# Altium project MQP_PCB.PrjPcb (part 1 of 2)
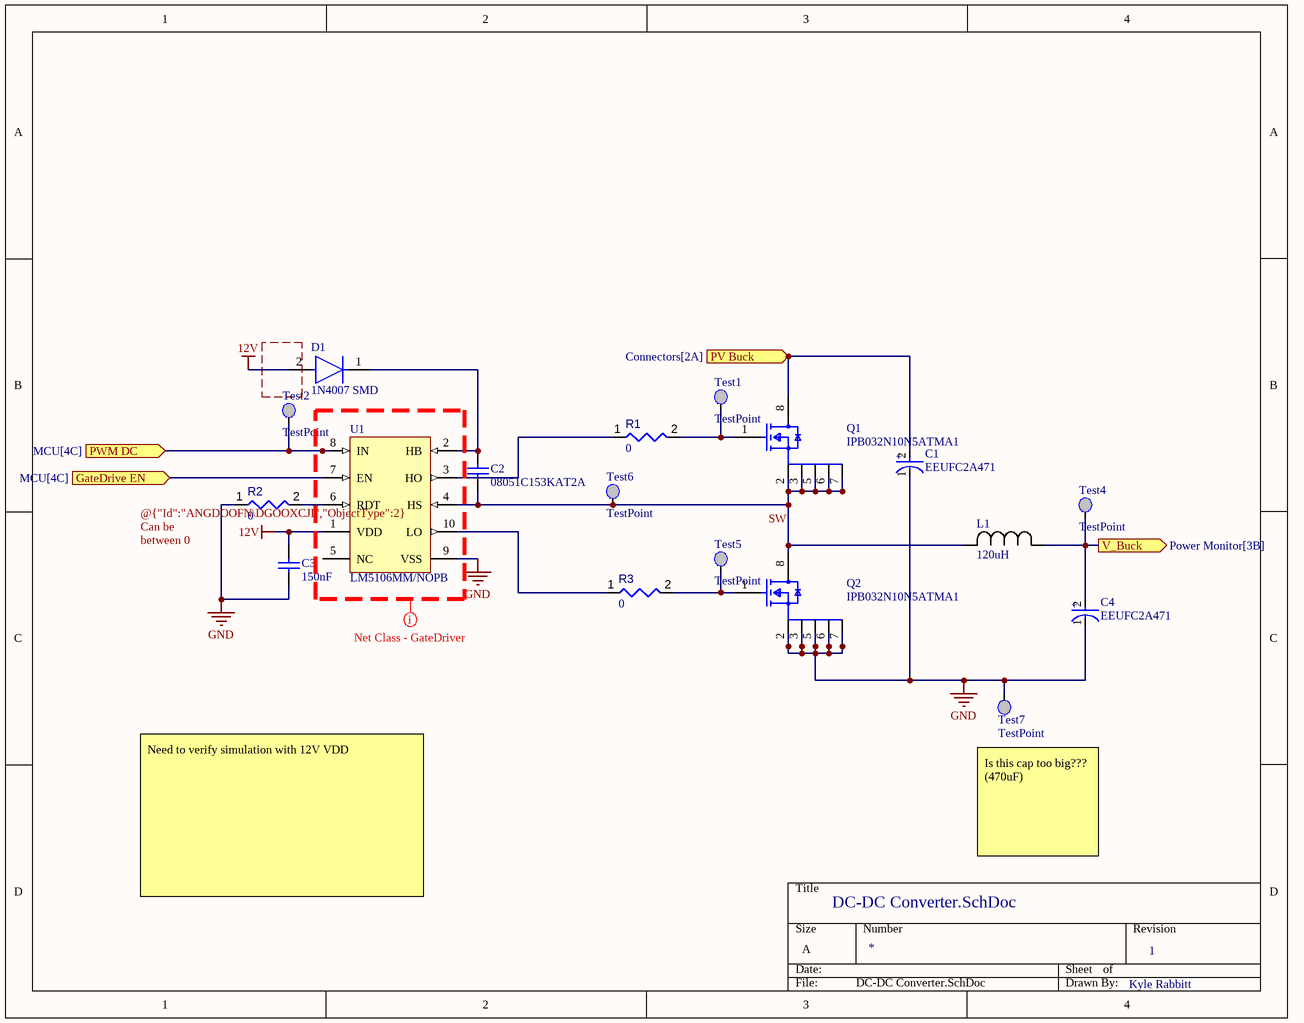
[diagram p0: DC-DC Converter.SchDoc]
Author: Kyle Rabbitt; Revision: 1
7 sheets, 188 parts. Net scope: flat (ports and power ports of the same name join across sheets).
Board files: 630-DC2044B_REV01_DESIGN_LAYOUT.PcbDoc, PCB_Main.PcbDoc
Sheets:
  DC-DC Converter.SchDoc
  MCU.SchDoc
  Sensors.SchDoc
  Voltage Regulator.SchDoc
  Power Monitor.SchDoc
  Connectors.SchDoc
  FCC Footprint Charge Controller.SchDoc

## Sheet DC-DC Converter.SchDoc
size A; SheetNumber: 1; SheetTotal: 7

### Parts
C1  EEUFC2A471  [FP-RAD-TH-D_16_0_5-L_40_2-MFG]
C2  08051C153KAT2A  [CAPC2013X94X50NL20T25]
C3  150nF  [CAPC2013X140X50LL20T25]
C4  EEUFC2A471  [FP-RAD-TH-D_16_0_5-L_40_2-MFG]
D1  1N4007 SMD  [FP-1N4007_SMD-IPC_C]
L1  120uH  [IND_2300HT-V_56_42]
Q1  IPB032N10N5ATMA1  [FP-PG-TO263-7-MFG]
Q2  IPB032N10N5ATMA1  [FP-PG-TO263-7-MFG]
R1  value 0  [RESC0603(1608)_L]  (hidden comment: 0R3J)
R2  value 0  [RESC0603(1608)_L]  (hidden comment: 0R3J)
R3  value 0  [RESC0603(1608)_L]  (hidden comment: 0R3J)
Test1  TestPoint  [Test_IN]  (no BOM)
Test2  TestPoint  [Test_IN]  (no BOM)
Test4  TestPoint  [Test_IN]  (no BOM)
Test5  TestPoint  [Test_IN]  (no BOM)
Test6  TestPoint  [Test_IN]  (no BOM)
Test7  TestPoint  [Test_IN]  (no BOM)
U1  LM5106MM/NOPB  [DGS0010A_N]

### Ports
GateDrive EN (in, see MCU[4C]), PV Buck (in, see Connectors[2A]), PWM DC (in, see MCU[4C]), V_Buck (out, see Power Monitor[3B])

### Nets
12V: C3.2 D1.2(A) U1.1(VDD)
GND: C1.1(C) C3.1 C4.1(C) Q2.2(SOURCE) Q2.3(SOURCE) Q2.5(SOURCE) Q2.6(SOURCE) Q2.7(SOURCE) R2.1 Test7.IN U1.9(VSS)
SW: C2.1 L1.2 Q1.2(SOURCE) Q1.3(SOURCE) Q1.5(SOURCE) Q1.6(SOURCE) Q1.7(SOURCE) Q2.8(DRAIN) Test6.IN U1.4(HS)
NetC1_2: C1.2(A) Q1.8(DRAIN) ; port PV Buck
NetC2_2: C2.2 D1.1(C) U1.2(HB)
NetC4_2: C4.2(A) L1.1 Test4.IN ; port V_Buck
NetQ1_1: Q1.1(GATE) R1.2 Test1.IN
NetQ2_1: Q2.1(GATE) R3.2 Test5.IN
NetR1_1: R1.1 U1.3(HO)
NetR2_2: R2.2 U1.6(RDT)
NetR3_1: R3.1 U1.10(LO)
NetTest2_IN: Test2.IN U1.8(IN) ; port PWM DC
NetU1_7: U1.7(EN) ; port GateDrive EN

Not connected (* = marked no-connect by the designer): U1 5(NC)

### Layout directives
net class GateDriver: (no net found under the mark)

### Notes on the sheet
- (near R2) @{"Id":"ANGDOOFN\DGOOXCJI","ObjectType":2} Can be between 0 and 150k
- Need to verify simulation with 12V VDD
- (near Test7) Is this cap too big???
  (470uF)
- (in symbol CMP-05427-000270-1) +

### Library data of the parts
C1 C4 = CMP-05427-000270-1: Aluminum Electrolytic Capacitors (Radial Lead Type) AEC-Q200 Qualified 470uF ±20% 100V; Ripple Current: 1.92A; Impedance: 47mR; Polarity: Polar; Dielectric Material: Aluminium; Lead Diameter: 0.8mm; Life (Hours): 5000Hour; Leakage Current: 3uA; Radiation Hardening: No; REACH SVHC: No SVHC; Height: 40mm; Ratings: AEC-Q200; Max Operating Temperature: 105°C; RoHS Compliant: Yes; Construction: RADIAL; Lead Pitch: 7.5mm; Contact Plating: Tin; Voltage: 100V; Length: 40mm; Packaging: Bulk; Diameter: 16mm; Height - Seated (Max): 1.575inch; Voltage Rating (DC): 100V; Voltage Rating: 100V; ESR (Equivalent Series Resistance): 47mR; Case/Package: Radial; Lead Free: Lead Free; Tolerance: 20%; Series: FC; Capacitance: 470uF; Package Quantity: 100; Mount: Through Hole; Min Operating Temperature: -55°C; Termination: Radial
C2 = CMP-2007-04180-1: 15nF / 0.01uF; Manufacturer: AVX Interconnect / Elco; Part Number: 08051C153KAT2A
C3 = CMP-1036-04480-3: 08053C154KAT2A; Manufacturer: AVX Interconnect / Elco; Part Number: 08053C154KAT2A
D1 = CMP-12389-000001-1: Rectifier, 1Kv, 1A, Do-214Ac Rohs Compliant: Yes
L1 = 2300HT-121-V-RC: 120uH / 2300HT-121-V-RC; Mfr_Name: Bourns Electronics
Q1 Q2 = CMP-32901-001276-1: MOSFET N-CH 100V 166A TO263-7; Input Capacitance: 6.97nF; Max Power Dissipation: 187W; Rds On Max: 3.2mR; Min Operating Temperature: -55°C; Mount: Surface Mount; RoHS Compliant: Yes; Continuous Drain Current (ID): 166A; Packaging: Tape and Reel; Case/Package: TO-263-7; Halogen Free: Halogen Free; Max Dual Supply Voltage: 100V; Lead Free: Contains Lead; Drain to Source Voltage (Vdss): 100V; Max Operating Temperature: 175°C; Series: OptiMOS™
R1-R3 = CMP-009-00063-2: Jumper 0603 (1608 Metric); Case/Package: 0603; Mounting Technology: SMT; Pins: 2
U1 = CMP-0063-01354-3: 100V Half-Bridge Gate Driver with Programmable Dead-Time, 10-pin MSOP, Pb-Free; Manufacturer: Texas Instruments; PackageTopMarking: ZXTT*5106; PowerWise: N; CompType: MiscPower; PinCount: 10; Code_JEDEC: MO-187-BA; PackageReference: DGS0010A; PackageDescription: Mini-SO, Molded, .118 x .118 x .034in Body, 10 Lead, .0197in Pitch; ComponentLink1URL: http://www.ti.com/general/docs/lit/getliterature.tsp?genericPartNumber=LM5106&fileType=pdf; ComponentLink1Description: Datasheet URL; RoHS: Y

## Sheet MCU.SchDoc
size A; SheetNumber: 2; SheetTotal: 7
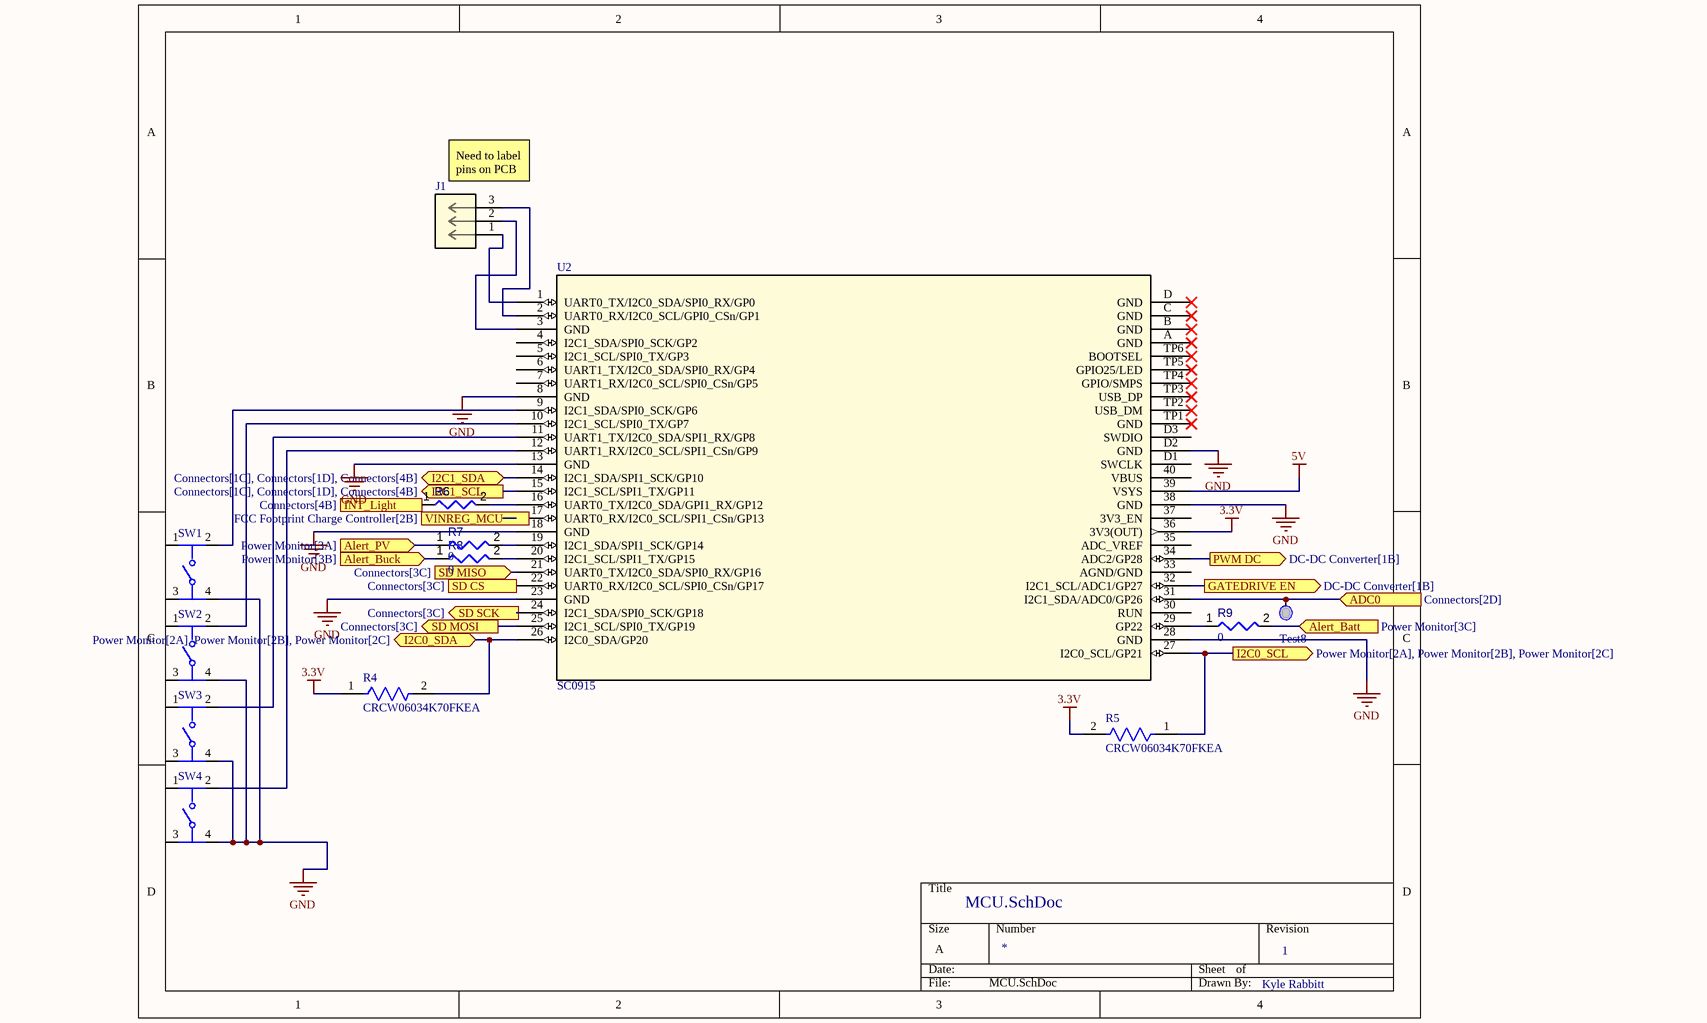
[diagram p1: MCU.SchDoc]

### Parts
J1  (no value)  [CONN_BM03B-SRSS-TBLFSN_JST]
R4  CRCW06034K70FKEA  [FP-CRCW0603-e3-IPC_A]
R5  CRCW06034K70FKEA  [FP-CRCW0603-e3-IPC_A]
R6  value 0  [RESC0603(1608)_L]  (hidden comment: 0R3J)
R7  value 0  [RESC0603(1608)_L]  (hidden comment: 0R3J)
R8  value 0  [RESC0603(1608)_L]  (hidden comment: 0R3J)
R9  value 0  [RESC0603(1608)_L]  (hidden comment: 0R3J)
SW1  (no value)  [FP-PTS645SM43SMTR92LFS-MFG]
SW2  (no value)  [FP-PTS645SM43SMTR92LFS-MFG]
SW3  (no value)  [FP-PTS645SM43SMTR92LFS-MFG]
SW4  (no value)  [FP-PTS645SM43SMTR92LFS-MFG]
Test8  TestPoint  [Test_IN]  (value not drawn)  (no BOM)
U2  SC0915  [SC0915_RPI]

### Ports
ADC0 (in, see Connectors[2D]), Alert_Batt (in, see Power Monitor[3C]), Alert_Buck (in, see Power Monitor[3B]), Alert_PV (in, see Power Monitor[3A]), GATEDRIVE EN (out, see DC-DC Converter[1B]), I2C0_SCL (out, see Power Monitor[2A], Power Monitor[2B], Power Monitor[2C]), I2C0_SDA (bidir, see Power Monitor[2A], Power Monitor[2B], Power Monitor[2C]), I2C1_SCL (out, see Connectors[1C], Connectors[1D], Connectors[4B]), I2C1_SDA (bidir, see Connectors[1C], Connectors[1D], Connectors[4B]), INT_Light (in, see Connectors[4B]), PWM DC (out, see DC-DC Converter[1B]), SD CS (out, see Connectors[3C]), SD MISO (in, see Connectors[3C]), SD MOSI (out, see Connectors[3C]), SD SCK (out, see Connectors[3C]), VINREG_MCU (out, see FCC Footprint Charge Controller[2B])

### Nets
3.3V: R4.1 R5.2 U2.36(3V3(OUT))
5V: U2.39(VSYS)
GND: SW1.4 SW2.4 SW3.4 SW4.4 U2.8(GND) U2.13(GND) U2.18(GND) U2.23(GND) U2.28(GND) U2.38(GND) U2.D2(GND)
NetJ1_1: J1.1 U2.1(UART0_TX/I2C0_SDA/SPI0_RX/GP0)
NetJ1_2: J1.2 U2.3(GND)
NetJ1_3: J1.3 U2.2(UART0_RX/I2C0_SCL/GPI0_CSn/GP1)
NetJ5_1: U2.14(I2C1_SDA/SPI1_SCK/GP10) ; port I2C1_SDA
NetJ5_3: U2.15(I2C1_SCL/SPI1_TX/GP11) ; port I2C1_SCL
NetJ5_4: R6.1 ; port INT_Light
NetJ8_2: U2.22(UART0_RX/I2C0_SCL/SPI0_CSn/GP17) ; port SD CS
NetJ8_3: U2.25(I2C1_SCL/SPI0_TX/GP19) ; port SD MOSI
NetJ8_5: U2.24(I2C1_SDA/SPI0_SCK/GP18) ; port SD SCK
NetJ8_7: U2.21(UART0_TX/I2C0_SDA/SPI0_RX/GP16) ; port SD MISO
NetJ12_3: Test8.IN U2.31(I2C1_SDA/ADC0/GP26) ; port ADC0
NetPINA1_5: R4.2 U2.26(I2C0_SDA/GP20) ; port I2C0_SDA
NetPINA1_6: R5.1 U2.27(I2C0_SCL/GP21) ; port I2C0_SCL
NetPINA1_10: R7.1 ; port Alert_PV
NetPINA2_10: R8.1 ; port Alert_Buck
NetPINA3_10: R9.2 ; port Alert_Batt
NetR6_2: R6.2 U2.16(UART0_TX/I2C0_SDA/GPI1_RX/GP12)
NetR7_2: R7.2 U2.19(I2C1_SDA/SPI1_SCK/GP14)
NetR8_2: R8.2 U2.20(I2C1_SCL/SPI1_TX/GP15)
NetR9_1: R9.1 U2.29(GP22)
NetSW1_2: SW1.2 U2.9(I2C1_SDA/SPI0_SCK/GP6)
NetSW2_2: SW2.2 U2.10(I2C1_SCL/SPI0_TX/GP7)
NetSW3_2: SW3.2 U2.11(UART1_TX/I2C0_SDA/SPI1_RX/GP8)
NetSW4_2: SW4.2 U2.12(UART1_RX/I2C0_SCL/SPI1_CSn/GP9)
NetTest2_IN: U2.34(ADC2/GP28) ; port PWM DC
NetU1_7: U2.32(I2C1_SCL/ADC1/GP27) ; port GATEDRIVE EN

Not connected (* = marked no-connect by the designer): SW1 1 3; SW2 1 3; SW3 1 3; SW4 1 3; U2 4(I2C1_SDA/SPI0_SCK/GP2) 5(I2C1_SCL/SPI0_TX/GP3) 6(UART1_TX/I2C0_SDA/SPI0_RX/GP4) 7(UART1_RX/I2C0_SCL/SPI0_CSn/GP5) 17(UART0_RX/I2C0_SCL/SPI1_CSn/GP13) 30(RUN) 33(AGND/GND) 35(ADC_VREF) 37(3V3_EN) 40(VBUS) A(GND)* B(GND)* C(GND)* D(GND)* D1(SWCLK) D3(SWDIO) TP1(GND)* TP2(USB_DM)* TP3(USB_DP)* TP4(GPIO/SMPS)* TP5(GPIO25/LED)* TP6(BOOTSEL)*

### Notes on the sheet
- (near J1) Need to label pins on PCB

### Library data of the parts
J1 = BM03B-SRSS-TBLFSN: No Description Available; Mfr_Name: JST; RefDes: RefDes; Type: Type
R4 R5 = CMP-1666-00019-3: RES Thick Film, 4.7kΩ, 1%, 0.1W, 100ppm/°C, 0603; Resistance: 4.7kR; Voltage Rating: 75V; Power Rating: 100mW; Case Code (Metric): 1608; Military Standard: Not; Packaging: Tape and Reel; Termination: SMD/SMT; Temperature Coefficient: 100ppm/°C; Lead Free: Lead Free; Length: 1.55mm; Width: 0.85mm; Height: 0.45mm; Depth: 0.85mm; Weight: 7.1E-05oz; Case Code (Imperial): 0603; Contact Plating: Tin; Case/Package: 0603; Max Operating Temperature: 155°C; Mount: Surface Mount; Tolerance: 1%; Min Operating Temperature: -55°C; Package Quantity: 5000; Voltage Rating (DC): 75V; Composition: Thick Film
R6-R9 = CMP-009-00063-2: Jumper 0603 (1608 Metric); Case/Package: 0603; Mounting Technology: SMT; Pins: 2
SW1-SW4 = CMP-2000-05160-2: SWITCH TACTILE SPST-NO 0.05A 12V; Contact Resistance: 100mR; Throw Configuration: SPST; Illumination Type: Non-Illuminated; Mechanical Life: 100000Cycles; Current Rating: 50mA; Switch Function: Off-Mom; Actuator Length: 0.85mm; Actuator Material: Nylon; Actuator Type: Standard; Operating Force: 160gf; Min Operating Temperature: -20°C; REACH SVHC: No SVHC; Termination: Gull Wing; Case/Package: SMD/SMT; Packaging: Tape and Reel; Mount: Surface Mount; Voltage Rating (DC): 12V; Orientation: Straight; Lead Free: Lead Free; Contact Material: Silver; Color: Black; Max Current Rating: 50mA; Contact Plating: Silver; Depth: 9mm; Package Quantity: 1; Max Voltage Rating (DC): 12V; Length: 6mm; Max Operating Temperature: 60°C
U2 = SC0915: No Description Available; Mfr_Name: Raspberry Pi; RefDes: RefDes; Type: Type

## Sheet Sensors.SchDoc
size A; SheetNumber: 3; SheetTotal: 8
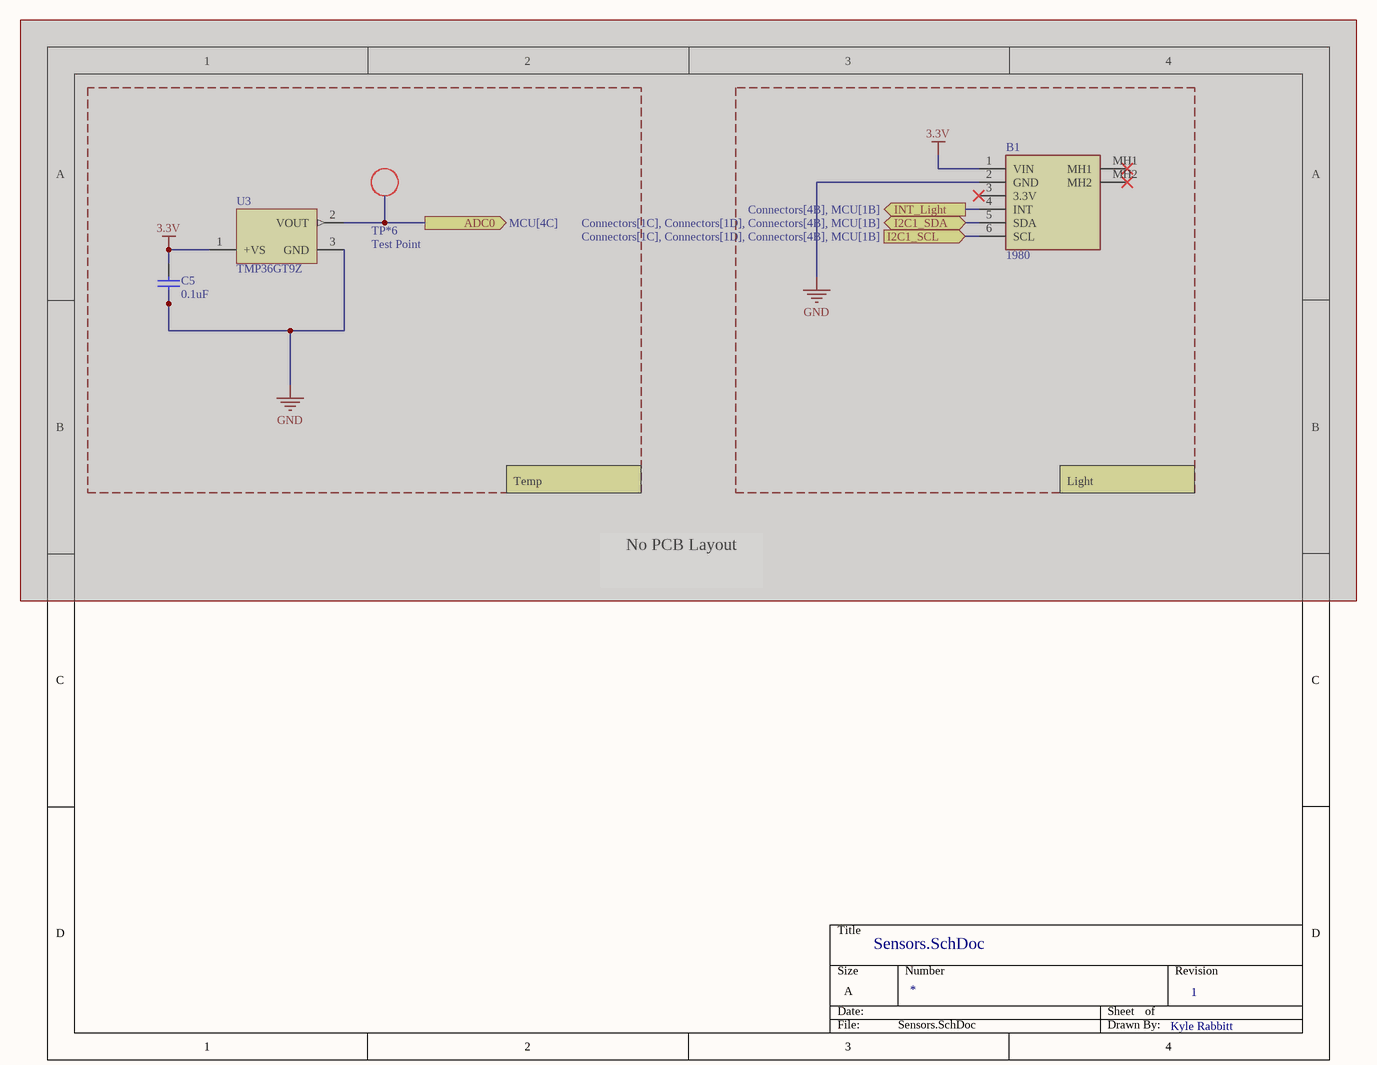
[diagram p2: Sensors.SchDoc]

### Parts
(Parts that share a designator on the sheet are numbered #1, #2 ... from top to bottom, then left to right.)
B1  1980  [1980]  (mechanical)  (masked out: inside a compile mask, not in the netlist)
C5#1  value 0.1uF  (hidden comment: Capacitor)  (masked out: inside a compile mask, not in the netlist)
TP*6  Test Point  [Test Point-Footprint-1]  (mechanical)  (masked out: inside a compile mask, not in the netlist)
U3#1  TMP36GT9Z  [ADI-T-3]  (mechanical)  (masked out: inside a compile mask, not in the netlist)

### Ports
ADC0 (out, see MCU[4C]), I2C1_SCL (in, see Connectors[1C], Connectors[1D], Connectors[4B], MCU[1B]), I2C1_SDA (bidir, see Connectors[1C], Connectors[1D], Connectors[4B], MCU[1B]), INT_Light (out, see Connectors[4B], MCU[1B])

### Notes on the sheet
- Temp
- Light
- No PCB Layout

### Library data of the parts
B1 = 1980: Optical Sensor Development Tools TSL2591 High Dynamic Digital Light Sensor; Manufacturer_Name: Adafruit; Geometry.Height: 3mm; Manufacturer_Part_Number: 1980; Mouser Part Number: 485-1980; Mouser Price/Stock: https://www.mouser.co.uk/ProductDetail/Adafruit/1980?qs=GURawfaeGuBXNh1gLjQA3Q%3D%3D; Arrow Part Number: 1980; Arrow Price/Stock: https://www.arrow.com/en/products/1980/adafruit-industries?region=nac; Datasheet Link: https://learn.adafruit.com/adafruit-tsl2591/downloads
C5#1 = Capacitor: SimulationGenericComponent: True
TP*6 = TP
U3#1 = CMP-0887-00067-1: Low Voltage Temperature Sensor, 2.7 to 5.5 V Supply, Industrial, 3-pin TO92 (T-3), Tray; Manufacturer: Analog Devices; ComponentLink2Description: Datasheet; PackageReference: T-3; Packing: Tray; ComponentLink2URL: http://www.analog.com/static/imported-files/data_sheets/TMP35_36_37.pdf; ComponentLink4Description: Product URL; ComponentLink3Description: Package Specification; Code_JEDEC: TO-226-AA; PartNumber: TMP36GT9Z; PackageDescription: 3-Pin Plastic Header-Style Package, 1.27 mm Pitch; PackageVersion: 042208-A, 04/2008; ComponentLink3URL: http://www.analog.com/static/imported-files/packages/PKG_PDF/TO-92(T)/T_3.pdf; ComponentLink1Description: Manufacturer URL; Supply Voltage Range: 2.7 to 5.5 V; Mounting Technology: Through Hole; DatasheetVersion: Rev. F; ComponentLink4URL: http://www.analog.com/en/mems-sensors/digital-temperature-sensors/tmp36/products/product.html; ComponentLink1URL: http://www.analog.com/en/index.html

## Sheet Voltage Regulator.SchDoc
size A; SheetNumber: 4; SheetTotal: 8
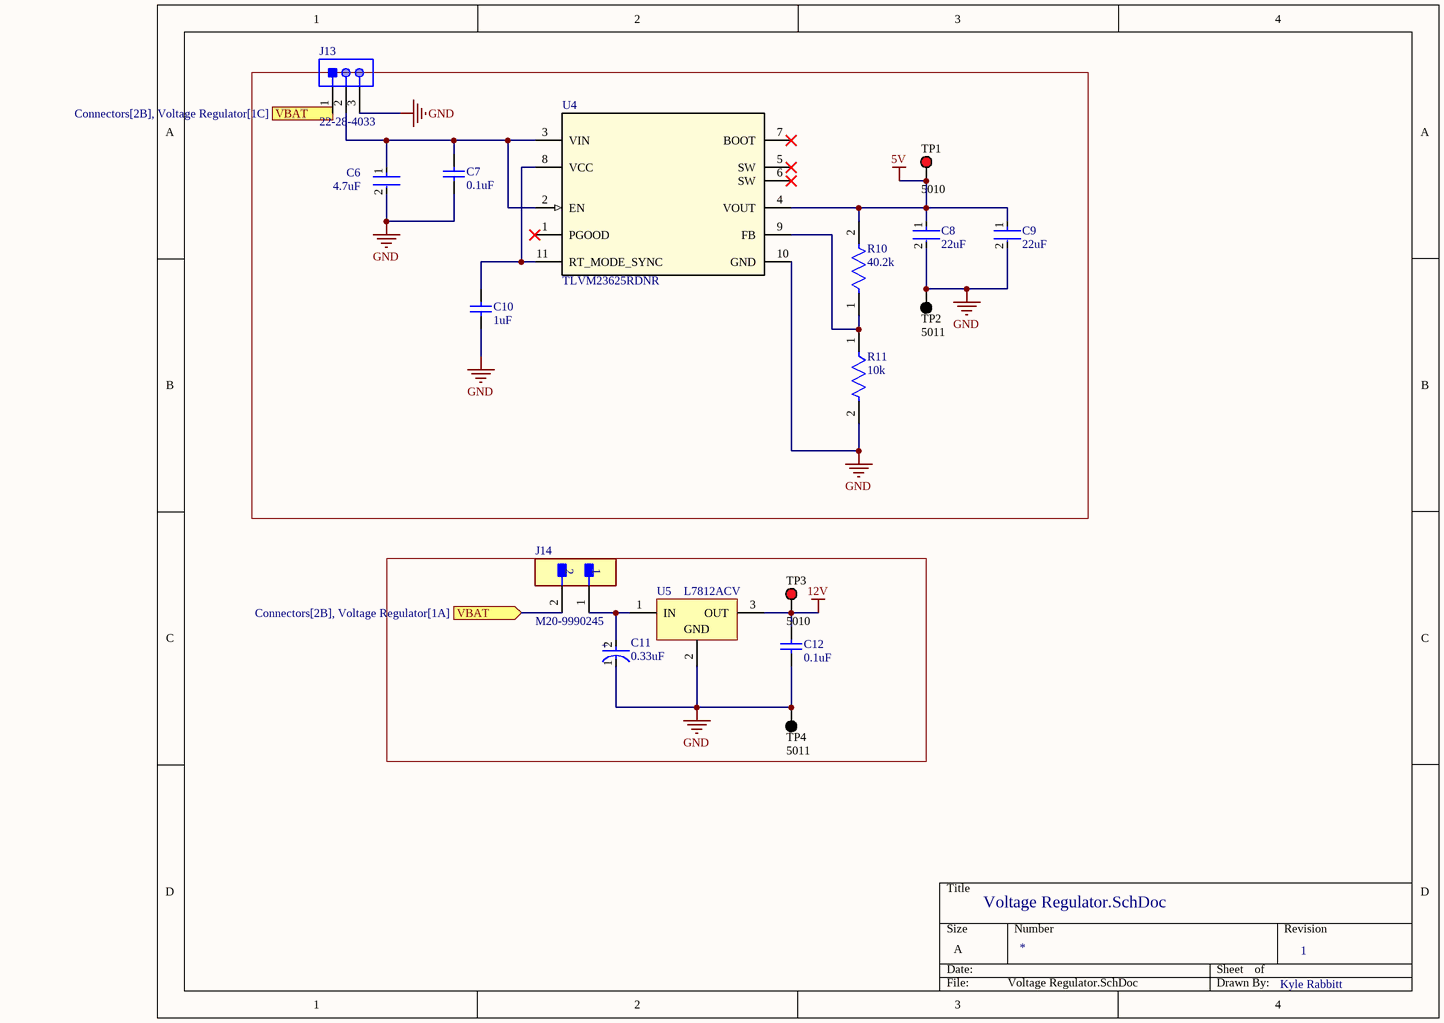
[diagram p3: Voltage Regulator.SchDoc]

### Parts
C6  4.7uF  [FP-C1210X475K5RACTU-MFG]
C7  0.1uF  [CAPC1608X90X35ML10T15]
C8  22uF  [FP-1210-L_3_3_0_4-W_2_5_0-MFG]
C9  22uF  [FP-1210-L_3_3_0_4-W_2_5_0-MFG]
C10  1uF  [CAPC2013X145X50LL20T25]
C11  0.33uF  [FP-TAJS-MFG]
C12  0.1uF  [CAPC1608X90X35ML10T15]
J13  22-28-4033  [MOLX-22-28-4033_V]
J14  M20-9990245  [FP-M20-9990245-MFG]
R10  40.2k  [FP-CRCW0603-e3-IPC_B]
R11  10k  [FP-MCT0603-IPC_C]
TP1  5010  [KSTN-5010_V]
TP2  5011  [KSTN-5011_V]
TP3  5010  [KSTN-5010_V]
TP4  5011  [KSTN-5011_V]
U4  TLVM23625RDNR  [RDN0011A-MFG]
U5  L7812ACV  [TO220]

### Ports
VBAT (in, see Connectors[2B], Voltage Regulator[1A]), VBAT (in, see Connectors[2B], Voltage Regulator[1C])

### Nets
5V: C8.1 C9.1 R10.2 TP1.1 U4.4(VOUT)
12V: C12.2 TP3.1 U5.3(OUT)
GND: C6.2 C7.1 C8.2 C9.2 C10.1 C11.1(C) C12.1 J13.3 R11.2 TP2.1 TP4.1 U4.10(GND) U5.2(GND)
NetC6_1: C6.1 C7.2 J13.2 U4.2(EN) U4.3(VIN)
NetC10_2: C10.2 U4.8(VCC) U4.11(RT_MODE_SYNC)
NetC11_2: C11.2(A) J14.1 U5.1(IN)
NetD3_1: J13.1 J14.2 ; port VBAT
NetR10_1: R10.1 R11.1 U4.9(FB)

Not connected (* = marked no-connect by the designer): U4 1(PGOOD)* 5(SW)* 6(SW)* 7(BOOT)*

### Notes on the sheet
- (in symbol CMP-04424-000233-1) +

### Library data of the parts
C6 = CMP-2000-06022-2: CAP CER 4.7UF 50V X7R 1210; Tolerance: 10%; Dielectric Material: Ceramic; Dissipation Factor: 2.5%; Voltage Rating: 50V; Case Code (Imperial): 1210; Case Code (Metric): 3225; Length: 3.3mm; Thickness: 0.11inch; Series: FT-CAP; Radiation Hardening: No; Min Operating Temperature: -55°C; Dielectric: X7R; RoHS Compliant: Yes; REACH SVHC: No SVHC; Mount: Surface Mount; Construction: Flat; Termination: SMD/SMT; Packaging: Tape and Reel; Voltage Rating (DC): 50V; Capacitance: 4.7uF; Depth: 2.5mm; Package Quantity: 1000; Width: 2.5mm; Features: Soft Termination; Number of Pins: 2; Voltage: 50V; Case/Package: 1210; Height: 2.5mm; Max Operating Temperature: 125°C
C7 C12 = CMP-2100-03643-1: Chip Capacitor, 0.1 uF, +/- 10%, 50 V, -55 to 125 degC, 0603 (1608 Metric), RoHS, Tape and Reel; Manufacturer: Murata; Dielectric Material: Ceramic; Voltage Rating: 50V; Capacitance: 100nF; Dielectric: X7R; Insulation Resistance: 10GR; Case Code (Metric): 1608; Lead Free: LeadFree; Depth: 0.8mm; Number of Pins: 2; Radiation Hardening: No; Case/Package: 0603; Manufacturer URL: http://www.murata.com/; Packaging: TapeandReel; Length: 1.6mm; Contact Plating: Tin; Datasheet URL: http://psearch.en.murata.com/capacitor/product/GRM188R71H104KA93%23.pdf; Tolerance: 10%; Case Code (Imperial): 0603; Min Operating Temperature: -55degC; RoHSCompliant: true; Voltage: 50V; Termination: SMD/SMT; Mount: SurfaceMount; Material: Ceramic; Package Quantity: 1; Height: 0.8mm; Thickness: 0.035inch; REACH SVHC: NoSVHC; Max Operating Temperature: 125degC; Width: 0.8mm; Package Reference: 0603; Voltage Rating (DC): 50V; Datasheet Version: 42675.0; Package Description: 2-Pin Surface Mount Device, Body 1.6 x 0.8 mm
C8 C9 = CMP-2000-05483-2: General Purpose Ceramic Capacitor, 1210, 22uF, 10%, X5R, 15%, 16V; Tolerance: 10%; Width: 0.098inch; Length: 3.2mm; Min Operating Temperature: -55°C; Capacitance: 22uF; Case/Package: 1210; Termination: SMD/SMT; Voltage: 16V; Number of Pins: 2; Thickness: 0.11inch; Height: 2.79mm; Weight: 0.000564oz; Case Code (Imperial): 1210; Contact Plating: Tin; Lead Free: Lead Free; RoHS Compliant: Yes; Packaging: Tape and Reel; Package Quantity: 1; Construction: Flat; Series: -; REACH SVHC: No SVHC; Case Code (Metric): 3225; Size: 2.79mm; Radiation Hardening: No; Voltage Rating: 16V; Depth: 2.5mm; Mount: Surface Mount; Voltage Rating (DC): 16V; Dielectric: X5R; Max Operating Temperature: 85°C
C10 = CMP-1036-04746-2: Manufacturer: Kemet; Part Number: C0805C105K4PACTU
C11 = CMP-04424-000233-1: 330nF 35V  ±10% 15Ω 1206  SMD Tantalum Capacitor; Leakage Current: 500nA; Polarity: Polar; ESR (Equivalent Series Resistance): 15R; Dissipation Factor: 4%; Max Operating Temperature: 125°C; Height: 1.2mm; Depth: 1.6mm; RoHS Compliant: Yes; Voltage Rating: 35V; Case Code (Imperial): 1206; REACH SVHC: No SVHC; Min Operating Temperature: -55°C; Termination: SMD/SMT; Width: 1.6mm; Radiation Hardening: No; Lead Free: Lead Free; Case Code (Metric): 3216; Height - Seated (Max): 0.047inch; Lead Pitch: 1.1mm; Case/Package: 1206; Series: TAJ; Package Quantity: 2500; Features: General Purpose; Length: 3.2mm; Packaging: Tape and Reel; Construction: Flat; Tolerance: 10%; Mount: Surface Mount; Capacitance: 330nF; Dielectric Material: Tantalum; Weight: 0.000571oz; Number of Pins: 2; Voltage Rating (DC): 35V
J13 = CMP-1676-00001-5: Male Header, Pitch 2.54 mm, 1 x 3 Position, Height 8.38 mm, Tail Length 3.18 mm, RoHS, Bulk; Manufacturer: Molex; Rows: 1; Voltage Rating: 250 V; Current Rating: 4 A; Min Operating Temperature: 0 degC; Lead Pitch: 0.1 inch; Packaging: Bulk; Contact Finish: Gold; RoHSCompliant: true; Contact Material: Brass; PackageReference: 22-28-4033; REACH SVHC: Unknown; PackageDescription: Male Header, Pitch 2.54 mm, 1 x 3 Position, Height 8.38 mm, Tail Length 3.18 mm; ComponentLink2URL: http://www.molex.com/pdm_docs/sd/022284033_sd.pdf; Height: 8.38 mm; Mounting Technology: Through Hole; ComponentLink1Description: Manufacturer URL; Length: 7.62 mm; Mount: Through Hole; DatasheetVersion: Rev. G, 01/2012; Max Operating Temperature: 75 degC; ComponentLink2Description: Datasheet; Colour: Black; Pins: 3; Contact Plating: Gold; Package Quantity: 1; ComponentLink1URL: http://www.molex.com/
J14 = CMP-15831-000105-1: CONN HEADER VERT 2POS 2.54MM; Working Voltage: 750V; Gender: Male; Number of Poles: 2; Current Rating: 3A; Mated Stacking Heights: 16.54mm; Contact Resistance: 25mR; Connector Type: Male Pin; Insulation Resistance: 10GR; Mating Cycles: 300; Voltage: 50V; Flammability Rating: UL94 V-0; Pitch: 2.54mm; Series: M20; Number of Contacts: 2; Height: 0.12inch; Min Operating Temperature: -40°C; Contact Finish - Mating: GOLD; Number of Positions: 2; Number of Rows: 1; Packaging: Bulk; Package Quantity: 1000; Voltage Rating (AC): 750V; Current: 3A; Mount: Through Hole; Case/Package: SIL; Orientation: Straight; Contact Shape: Square; Weight: 0.25lb; Radiation Hardening: No; Fastening Type: Pull; Length: 5.08mm; Depth: 2.54mm; Contact Mating Length: 0.24inch; Housing Material: Nylon; Reach SVHC Compliant: Yes; Insulation Material: Nylon; Color: Black; Width: 0.25inch; Insulation Color: Black; Contact Material: Brass; Contact Type: Male Pin; Termination: Solder; Max Operating Temperature: 105°C; Contact Plating: Gold; Housing Color: Black; Max Current Rating: 3A; Lead Pitch: 2.54mm
R10 = CMP-2000-03336-2: RES Thick Film, 40.2kΩ, 1%, 0.1W, 100ppm/°C, 0603; Voltage Rating (DC): 75V; Power Rating: 100mW; Resistance: 40.2kR; Packaging: Tape and Reel; Radiation Hardening: No; Lead Free: Lead Free; Contact Plating: Tin; Weight: 7.1E-05oz; Voltage Rating: 75V; Temperature Coefficient: 100ppm/°C; Case Code (Imperial): 0603; Max Operating Temperature: 155°C; Width: 0.85mm; Package Quantity: 5000; Termination: SMD/SMT; Case/Package: 0603; Case Code (Metric): 1608; Depth: 0.85mm; Tolerance: 1%; Composition: Thick Film; Length: 1.55mm; Military Standard: Not; Height: 0.45mm; Min Operating Temperature: -55°C
R11 = CMP-02407-000418-1: RES SMD 100 OHM 1% 1/8W 0603; Voltage Rating: 75V; Power Rating: 100mW; Temperature Coefficient: 50ppm/°C; Max Power Dissipation: 125mW; Resistance: 10kR; Case/Package: 0603; Military Standard: Not; Min Operating Temperature: -55°C; Width: 0.8mm; Package Quantity: 1; Max Operating Temperature: 125°C; Tolerance: 1%; Depth: 0.85mm; Radiation Hardening: No; Mount: Surface Mount; Composition: Thin Film; Contact Plating: Tin; Lead Free: Lead Free; Case Code (Imperial): 0603; Number of Terminations: 2; Voltage Rating (DC): 75V; Length: 1.55mm; Packaging: Tape and Reel; Height: 0.022inch; Case Code (Metric): 1608
TP1 TP3 = CMP-1672-00002-4: Test Point, Red, Through Hole, RoHS, Bulk; Manufacturer: Keystone; Contact Material: Bronze; Mounting Technology: Through Hole; RoHSCompliant: true; Pins: 1; Package Quantity: 100; ComponentLink2Description: Datasheet; Height: 8.12 mm; ComponentLink1URL: http://www.keyelco.com/; DatasheetVersion: Rev. F, 12/2013; Mount: Through Hole; PackageReference: 5010; Contact Plating: Silver; Packaging: Bulk; Colour: Red; REACH SVHC: No SVHC; PackageDescription: 1-Pin Through Hole Device, Dia 3.17 mm; ComponentLink2URL: http://www.keyelco.com/product-pdf.cfm?p=1319; ComponentLink1Description: Manufacturer URL
TP2 TP4 = CMP-1672-00003-4: Test Point, Black, Through Hole, RoHS, Bulk; Manufacturer: Keystone; ComponentLink2URL: http://www.keyelco.com/product-pdf.cfm?p=1320; Colour: Black; Pins: 1; REACH SVHC: No SVHC; ComponentLink1URL: http://www.keyelco.com/; PackageReference: 5011; Contact Plating: Silver; Package Quantity: 100; Packaging: Bulk; RoHSCompliant: true; Height: 8.12 mm; PackageDescription: 1-Pin Through Hole Device, Dia 3.17 mm; Mount: Through Hole; Mounting Technology: Through Hole; DatasheetVersion: Rev. F, 12/2013; ComponentLink1Description: Manufacturer URL; Contact Material: Bronze; ComponentLink2Description: Datasheet
U4 = TLVM23625RDNR: No Description Available; Mfr_Name: Texas Instruments; TYPE: TYPE; RefDes: RefDes
U5 = CMP-0244-00451-1: Positive Voltage Regulator, 12V, 3-Pin TO-220; PackageDescription: TO, Thru-Hole, Vertical, Heatsink Mounted; 3 In-Line Leads; Pitch 2.54 mm; ComponentLink3URL: http://www.st.com/internet/com/TECHNICAL_RESOURCES/TECHNICAL_LITERATURE/PACKAGE_INFORMATION/CD00004649.pdf; ComponentLink3Description: Package Specification; DatasheetVersion: 16/11/2011; ComponentLink1Description: Manufacturer URL; PackageVersion: ver3.0; PackageReference: TO220; ComponentLink1URL: http://www.st.com; ComponentLink2Description: Datasheet; ComponentLink2URL: http://www.st.com/internet/com/TECHNICAL_RESOURCES/TECHNICAL_LITERATURE/DATASHEET/CD00000444.pdf

## Sheet Power Monitor.SchDoc
size A; SheetNumber: 5; SheetTotal: 7
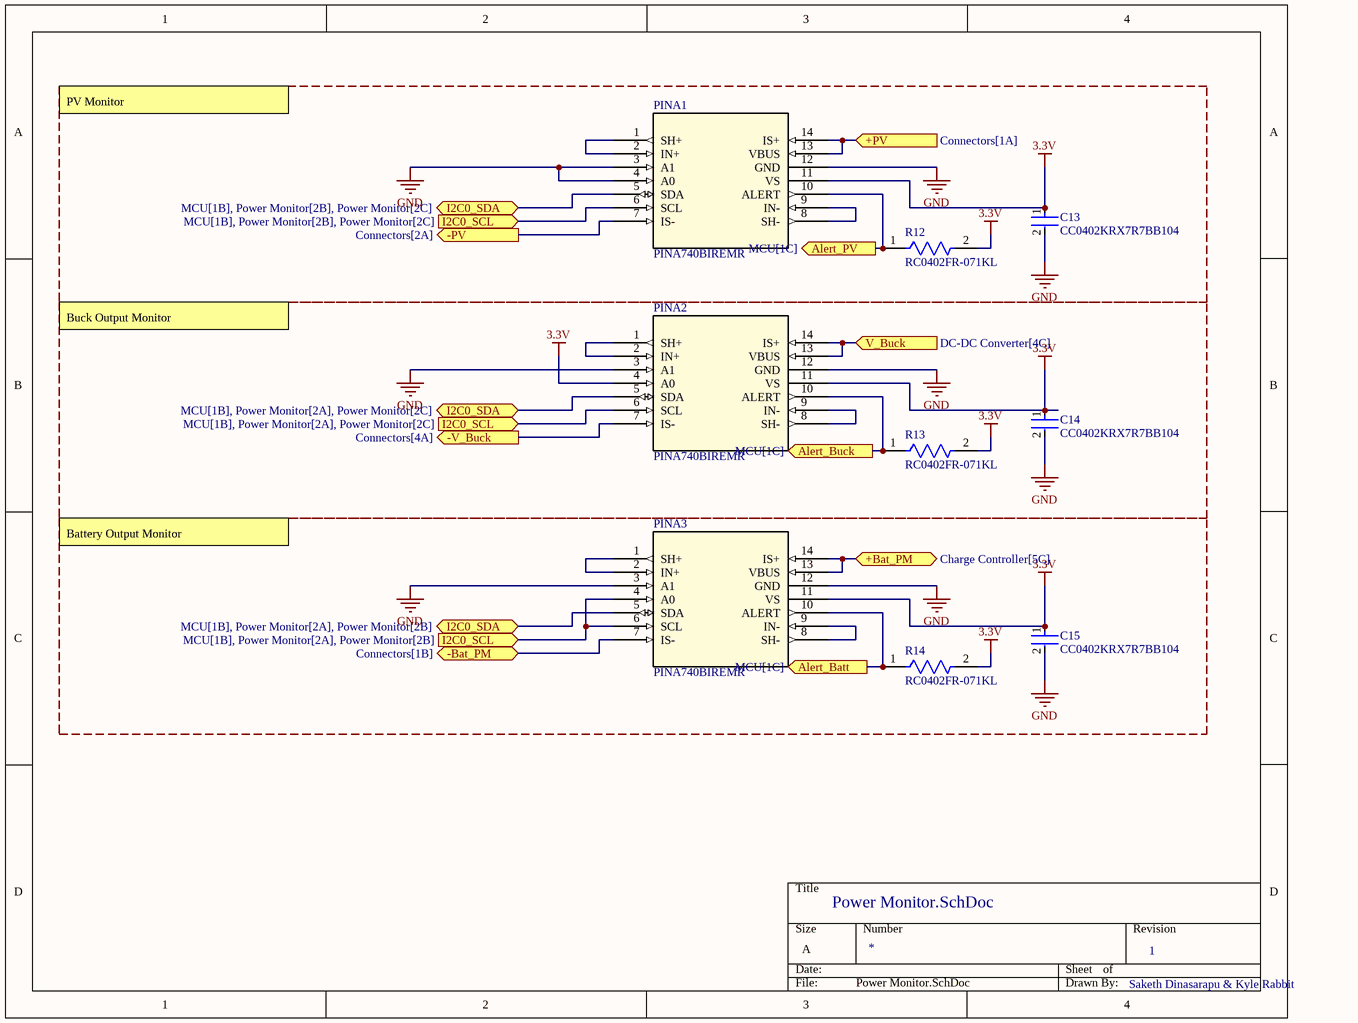
[diagram p4: Power Monitor.SchDoc]

### Parts
C13  CC0402KRX7R7BB104  [FP-CC0402-MFG]
C14  CC0402KRX7R7BB104  [FP-CC0402-MFG]
C15  CC0402KRX7R7BB104  [FP-CC0402-MFG]
PINA1  PINA740BIREMR  [VQFN14_REM_TEX]
PINA2  PINA740BIREMR  [VQFN14_REM_TEX]
PINA3  PINA740BIREMR  [VQFN14_REM_TEX]
R12  RC0402FR-071KL  [FP-RC0402-0_4-IPC_A]
R13  RC0402FR-071KL  [FP-RC0402-0_4-IPC_A]
R14  RC0402FR-071KL  [FP-RC0402-0_4-IPC_A]

### Ports
+Bat_PM (bidir, see Charge Controller[5C]), +PV (in, see Connectors[1A]), -Bat_PM (bidir, see Connectors[1B]), -PV (out, see Connectors[2A]), -V_Buck (out, see Connectors[4A]), Alert_Batt (out, see MCU[1C]), Alert_Buck (out, see MCU[1C]), Alert_PV (out, see MCU[1C]), I2C0_SCL (in, see MCU[1B], Power Monitor[2A], Power Monitor[2B]), I2C0_SCL (in, see MCU[1B], Power Monitor[2A], Power Monitor[2C]), I2C0_SCL (in, see MCU[1B], Power Monitor[2B], Power Monitor[2C]), I2C0_SDA (bidir, see MCU[1B], Power Monitor[2A], Power Monitor[2B]), I2C0_SDA (bidir, see MCU[1B], Power Monitor[2A], Power Monitor[2C]), I2C0_SDA (bidir, see MCU[1B], Power Monitor[2B], Power Monitor[2C]), V_Buck (in, see DC-DC Converter[4C])

### Nets
3.3V: C13.1 C14.1 C15.1 PINA1.11(VS) PINA2.4(A0) PINA2.11(VS) PINA3.11(VS) R12.2 R13.2 R14.2
GND: C13.2 C14.2 C15.2 PINA1.3(A1) PINA1.4(A0) PINA1.12(GND) PINA2.3(A1) PINA2.12(GND) PINA3.3(A1) PINA3.12(GND)
BAT: PINA3.13(VBUS) PINA3.14(IS+) ; port +Bat_PM
Net1_2: PINA3.7(IS-) ; port -Bat_PM
NetC4_2: PINA2.13(VBUS) PINA2.14(IS+) ; port V_Buck
NetJ2_2: PINA1.7(IS-) ; port -PV
NetJ3_2: PINA2.7(IS-) ; port -V_Buck
NetPINA1_1: PINA1.1(SH+) PINA1.2(IN+)
NetPINA1_5: PINA1.5(SDA) PINA2.5(SDA) PINA3.5(SDA) ; port I2C0_SDA
NetPINA1_6: PINA1.6(SCL) PINA2.6(SCL) PINA3.4(A0) PINA3.6(SCL) ; port I2C0_SCL
NetPINA1_8: PINA1.8(SH-) PINA1.9(IN-)
NetPINA1_10: PINA1.10(ALERT) R12.1 ; port Alert_PV
NetPINA1_13: PINA1.13(VBUS) PINA1.14(IS+) ; port +PV
NetPINA2_1: PINA2.1(SH+) PINA2.2(IN+)
NetPINA2_8: PINA2.8(SH-) PINA2.9(IN-)
NetPINA2_10: PINA2.10(ALERT) R13.1 ; port Alert_Buck
NetPINA3_1: PINA3.1(SH+) PINA3.2(IN+)
NetPINA3_8: PINA3.8(SH-) PINA3.9(IN-)
NetPINA3_10: PINA3.10(ALERT) R14.1 ; port Alert_Batt

### Notes on the sheet
- PV Monitor
- Buck Output Monitor
- Battery Output Monitor
- Saketh Dinasarapu & Kyle Rabbit

### Library data of the parts
C13-C15 = CMP-03422-000048-1: CAP CER 0.1UF 16V X7R 0402; Manufacturer: YAGEO; Material: Ceramic; Automotive Grade: NA; Capacitance: 100 nF; Temperature Coefficient: 30ppm/°C; Tolerance: 0.1; Value: 100 nF; Device Class L1: Passive Components; Temperature Range Low: -55°C; Device Class L3: Ceramic Capacitors; Temperature Characteristic: X7R; Ipc Land Pattern Name: CAPC10050X50; Temperature Range High: +125°C; Voltage Rating: 16 V; Temperature: -55°C to +125°C; RoHS: TRUE; Automotive: No; Height: 0.55mm; Device Class L2: Capacitors; Digikey Description: CAP CER 0.1UF 16V X7R 0402; Package: CC0402; Footprint Url: http://www.yageo.com/exep/pages/download/literatures/UPY-C_GEN_24.pdf; ComponentLink2Description: Datasheet; Category: Cap; Lead Free: Yes; Octopart: https://octopart.com/cc0402krx7r7bb104-yageo-42244624; ComponentLink2URL: http://www.yageo.com/documents/recent/UPY-GP_NP0_16V-to-50V_16.pdf; Manufacturer Part Number: CC0402KRX7R7BB104; Mouser Description: 0402 0.1 uF 16 V ±10 % Tolerance X7R SMT Multilayer Ceramic Capacitor
PINA1-PINA3 = PINA740BIREMR: No Description Available; Mfr_Name: Texas Instruments; Type: Linear; RefDes: RefDes
R12-R14 = CMP-2002-07472-3: RES 1K OHM 1% 1/16W 0402; Max Power Dissipation: 63mW; Resistance: 1kR; Voltage Rating (DC): 50V; Temperature Coefficient: 100ppm/°C; Power Rating: 62.5mW; Technology: THICK FILM; Size Code: 0402; Series: RC; Length: 1mm; Case/Package: 0402; Features: Moisture Resistant; Termination: SMD/SMT; Case Code (Metric): 1005; Reach SVHC Compliant: Yes; Number of Terminations: 2; Tolerance: 1%; Lead Free: Lead Free; Military Standard: Not; Resistor Type: Thick Film; Max Operating Temperature: 155°C; RoHS Compliant: Yes; Construction: Rectangular; Voltage Rating: 50V; Packaging: Tape and Reel; Height: 0.32mm; Number of Pins: 2; Resistance Tolerance: 1%; Case Code (Imperial): 0402; Depth: 0.5mm; Min Operating Temperature: -55°C; Width: 0.5mm

## Sheet Connectors.SchDoc
size A; SheetNumber: 6; SheetTotal: 8
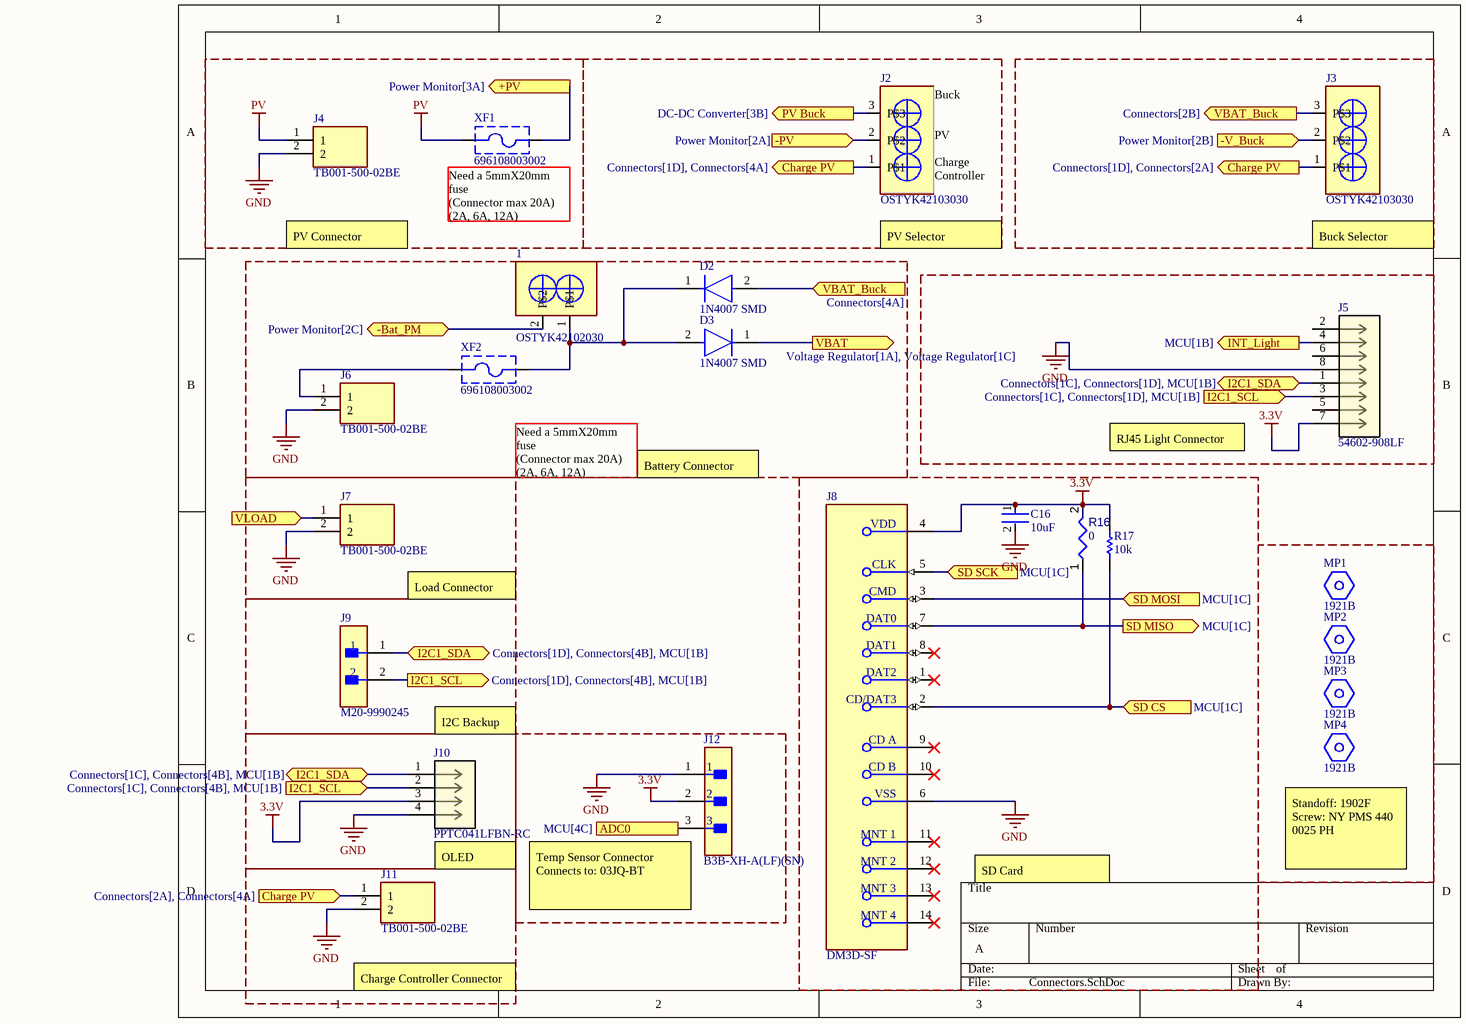
[diagram p5: Connectors.SchDoc]

### Parts
1  OSTYK42102030  [OSTYK42102030]
C16  10uF  [FP-GRM188-0_1-e0_2_0_55-IPC_A]
D2  1N4007 SMD  [FP-1N4007_SMD-IPC_C]
D3  1N4007 SMD  [FP-1N4007_SMD-IPC_C]
J2  OSTYK42103030  [OSTYK42103030]
J3  OSTYK42103030  [OSTYK42103030]
J4  TB001-500-02BE  [CUI_TB001-500-02BE]
J5  54602-908LF  [CONN8_2-908LF_AMP]
J6  TB001-500-02BE  [CUI_TB001-500-02BE]
J7  TB001-500-02BE  [CUI_TB001-500-02BE]
J8  DM3D-SF  [FP-DM3D-SF-MFG]
J9  M20-9990245  [FP-M20-9990245-MFG]
J10  PPTC041LFBN-RC  [CONN_PPTC041LFBN-RC_SUL]
J11  TB001-500-02BE  [CUI_TB001-500-02BE]
J12  B3B-XH-A(LF)(SN)  [FP-B3B-XH-A_LF_SN-MFG]
MP1  1921B  [FP-1921B-MFG]
MP2  1921B  [FP-1921B-MFG]
MP3  1921B  [FP-1921B-MFG]
MP4  1921B  [FP-1921B-MFG]
R16  value 0  [RESC0603(1608)_L]  (hidden comment: 0R3J)
R17  10k  [RESC1609X50X30NL8T20]
XF1  696108003002  [696108003002]
XF2  696108003002  [696108003002]

### Ports
+PV (out, see Power Monitor[3A]), -Bat_PM (bidir, see Power Monitor[2C]), -PV (in, see Power Monitor[2A]), -V_Buck (in, see Power Monitor[2B]), ADC0 (see MCU[4C]), Charge PV (in, see Connectors[2A], Connectors[4A]), Charge PV (out, see Connectors[1D], Connectors[2A]), Charge PV (out, see Connectors[1D], Connectors[4A]), I2C1_SCL (in, see Connectors[1C], Connectors[1D], MCU[1B]), I2C1_SCL (in, see Connectors[1C], Connectors[4B], MCU[1B]), I2C1_SCL (out, see Connectors[1D], Connectors[4B], MCU[1B]), I2C1_SDA (bidir, see Connectors[1C], Connectors[1D], MCU[1B]), I2C1_SDA (bidir, see Connectors[1C], Connectors[4B], MCU[1B]), I2C1_SDA (bidir, see Connectors[1D], Connectors[4B], MCU[1B]), INT_Light (out, see MCU[1B]), PV Buck (out, see DC-DC Converter[3B]), SD CS (in, see MCU[1C]), SD MISO (out, see MCU[1C]), SD MOSI (in, see MCU[1C]), SD SCK (in, see MCU[1C]), VBAT (out, see Voltage Regulator[1A], Voltage Regulator[1C]), VBAT_Buck (in, see Connectors[4A]), VBAT_Buck (out, see Connectors[2B]), VLOAD (in)

### Nets
3.3V: C16.1 J5.7 J8.4(VDD) J10.3 J12.2 R16.2 R17.2
GND: C16.2 J4.2 J5.8 J6.2 J7.2 J8.6(VSS) J10.4 J11.2 J12.1
PV: J4.1 XF1.1
VIN: J2.1(P$1) J3.1(P$1) J11.1 ; port Charge PV
VOUT: J7.1 ; port VLOAD
Net1_1: 1.1(P$1) D2.1(C) D3.2(A) XF2.2
Net1_2: 1.2(P$2) ; port -Bat_PM
NetC1_2: J2.3(P$3) ; port PV Buck
NetD2_2: D2.2(A) J3.3(P$3) ; port VBAT_Buck
NetD3_1: D3.1(C) ; port VBAT
NetJ2_2: J2.2(P$2) ; port -PV
NetJ3_2: J3.2(P$2) ; port -V_Buck
NetJ5_1: J5.1 J9.1 J10.1 ; port I2C1_SDA
NetJ5_3: J5.3 J9.2 J10.2 ; port I2C1_SCL
NetJ5_4: J5.4 ; port INT_Light
NetJ6_1: J6.1 XF2.1
NetJ8_2: J8.2(CD/DAT3) R17.1 ; port SD CS
NetJ8_3: J8.3(CMD) ; port SD MOSI
NetJ8_5: J8.5(CLK) ; port SD SCK
NetJ8_7: J8.7(DAT0) R16.1 ; port SD MISO
NetJ12_3: J12.3 ; port ADC0
NetPINA1_13: XF1.2 ; port +PV

Not connected (* = marked no-connect by the designer): J5 2 5 6; J8 1(DAT2)* 8(DAT1)* 9(CD_A)* 10(CD_B)* 11(MNT_1)* 12(MNT_2)* 13(MNT_3)* 14(MNT_4)*

### Notes on the sheet
- (near XF1) Need a 5mmX20mm fuse
  (Connector max 20A)
  (2A, 6A, 12A)
- Buck
  PV
  Charge Controller
- PV Connector
- PV Selector
- Buck Selector
- Need a 5mmX20mm fuse
  (Connector max 20A)
  (2A, 6A, 12A)
- Battery Connector
- RJ45 Light Connector
- Load Connector
- (near J10) I2C Backup
- (near J10) OLED
- (near J12) Temp Sensor Connector
  Connects to: 03JQ-BT
- SD Card
- (near MP4) Standoff: 1902F
  Screw: NY PMS 440 0025 PH
- Charge Controller Connector

### Library data of the parts
1 = OSTYK42102030: 2 Circuit 0.325 _8.26mm_ Barrier Block Connector, Screws with Captive Plate; MF: On Shore; Value: *; SnapEDA_Link: https://www.snapeda.com/parts/OSTYK42102030/On%20Shore%20Technology%20Inc./view-part/3076180/?ref=snap; Package: None; MP: OSTYK42102030; Availability: Unavailable; Price: None
C16 = CMP-2006-02792-2: Chip Multilayer Ceramic Capacitors for General Purpose, 0603, 10uF, X5R, 15%, 20%, 6.3V / GRM188R60J106ME47D; Packaging: Tape and Reel; Voltage Rating (DC): 6.3V; Width: 0.031inch; Termination: SMD/SMT; Dielectric: X5R; Package Quantity: 4000; Voltage Rating: 6.3V; Capacitance: 10uF; Case/Package: 0603; Min Operating Temperature: -55°C; Voltage: 6.3V; Length: 1.6mm; Thickness: 0.035inch; Lead Free: Lead Free; Depth: 0.8mm; Case Code (Imperial): 0603; Max Operating Temperature: 85°C; Material: Ceramic; Height: 0.8mm; Tolerance: 20%; Mount: Surface Mount; REACH SVHC: No SVHC; Radiation Hardening: No; Case Code (Metric): 1608
D2 D3 = CMP-12389-000001-1: as D1 on sheet DC-DC Converter
J2 J3 = CMP-002-00251-1: 3 Circuit 0.325 (8.26mm) Barrier Block Connector, Screws with Captive Plate; MF: On Shore; Case/Package: None; Price: None; Value: *; Purchase-URL: https://pricing.snapeda.com/search/part/OSTYK42103030/?ref=eda; Availability: In Stock; SnapEDA_Link: https://www.snapeda.com/parts/OSTYK42103030/On+Shore+Technology+Inc./view-part/?ref=snap; MP: OSTYK42103030; Pins: 3; Design Item ID: OSTYK42103030; Component Type: Standard; Check_prices: https://www.snapeda.com/parts/OSTYK42103030/On+Shore+Technology+Inc./view-part/?ref=eda; Source: OSTYK42103030.SchLib
J4 J6 J7 J11 = TB001-500-02BE: 2~24 Poles, Screw Type, Horizontal, 5.0 Pitch, 22~12 (AWG), Terminal Block Connector; MF: CUI Devices; Purchase-URL: https://pricing.snapeda.com/search/part/TB001-500-02BE/?ref=eda; CUI_purchase_URL: https://www.cuidevices.com/product/interconnect/connectors/terminal-blocks/tb001-500-series?utm_source=snapeda.com&utm_medium=referral&utm_campaign=snapedaBOM; Check_prices: https://www.snapeda.com/parts/TB001-500-02BE/CUI+Devices/view-part/?ref=eda; SnapEDA_Link: https://www.snapeda.com/parts/TB001-500-02BE/CUI+Devices/view-part/?ref=snap; Value: *; Digi-Key_Part_Number: 102-6134-ND; Package: None; MP: TB001-500-02BE
J5 = 54602-908LF: No Description Available; Mfr_Name: Amphenol ICC; RefDes: RefDes; Type: Type
J8 = CMP-2000-06166-2: CONN MICRO SD CARD PUSH-PULL; Insulation Resistance: 1GR; Max Voltage Rating (AC): 125V; Gender: Female; Contact Resistance: 100mR; Current Rating: 500mA; Pitch: 1.1mm; Connector Type: Connector; Number of Contacts: 8; Contact Plating: Gold; Number of Rows: 1; Termination: Solder; Contact Material: Copper Alloy; REACH SVHC: No SVHC; Voltage Rating (AC): 125V; Packaging: Tape and Reel; Housing Material: Polymer; Max Operating Temperature: 85°C; Package Quantity: 1; Min Operating Temperature: -25°C; Lead Free: Lead Free; Orientation: Right Angle; Radiation Hardening: No; Flammability Rating: UL94 V-0; Mount: Surface Mount; Depth: 11.45mm; Max Current Rating: 500mA; Length: 11.95mm; Width: 11.95mm
J9 = CMP-15831-000105-1: as J14 on sheet Voltage Regulator; Flammability Rating: UL94 V-0; Pitch: 2.54mm; Series: M20; Number of Contacts: 2; Height: 0.12inch; Min Operating Temperature: -40°C; Contact Finish - Mating: GOLD; Number of Positions: 2; Number of Rows: 1; Packaging: Bulk; Package Quantity: 1000; Voltage Rating (AC): 750V; Current: 3A; Mount: Through Hole; Case/Package: SIL; Orientation: Straight; Contact Shape: Square; Weight: 0.25lb; Radiation Hardening: No; Fastening Type: Pull; Length: 5.08mm; Depth: 2.54mm; Contact Mating Length: 0.24inch; Housing Material: Nylon; Reach SVHC Compliant: Yes; Insulation Material: Nylon; Color: Black; Width: 0.25inch; Insulation Color: Black; Contact Material: Brass; Contact Type: Male Pin; Termination: Solder; Max Operating Temperature: 105°C; Contact Plating: Gold; Housing Color: Black; Max Current Rating: 3A; Lead Pitch: 2.54mm
J10 = PPTC041LFBN-RC: No Description Available; Mfr_Name: Sullins; RefDes: RefDes; Type: Type
J12 = CMP-17439-000014-3: CONN HEADER VERT 3POS 2.5MM; Max Voltage Rating (DC): 250V; Number of Positions: 3; Current Rating: 3A; Gender: Male; Wire/Cable Gauge: 22AWG; Contact Resistance: 20mR; Insulation Resistance: 1GR; Insulation Material: Nylon; Contact Plating: Tin; Depth: 5.75mm; Contact Type: Male Pin; Max Operating Temperature: 85°C; Insulation Color: Natural; Voltage Rating (AC): 250V; Color: Natural; Connector Type: Header; Orientation: Straight; Fastening Type: Detent; Housing Color: White; Min Operating Temperature: -25°C; Termination: Solder; Voltage Rating: 250V; Series: XH; Pitch: 2.5mm; Contact Shape: Square; Number of Rows: 1; Lead Free: Lead Free; Packaging: Bulk; Mount: Through Hole; Flammability Rating: UL94 V-0; Max Voltage Rating (AC): 250V; REACH SVHC: No SVHC; Housing Material: Polyamide; Contact Material: Brass; Lead Pitch: 2.5mm; Contact Finish - Mating: TIN; Length: 9.9mm; Max Current Rating: 3A; Number of Contacts: 3
MP1-MP4 = CMP-00214-00374361-1: 1921B Standoff, 1/4 Hex, Female, Threaded 4-40, Length .500, Stainless Steel; NexarPartId: 374361; Outside Diameter: 6.35mm; Gender: Female, Female; Length: 12.7mm; Threaded/Unthreaded: Threaded; Width: 6.35mm; Color: Natural; Shape: Hex; RoHS: Compliant; Lead Free: Lead Free; Material: Stainless Steel; Height: 12.827mm; Diameter: 6.35mm
R16 = CMP-009-00063-2: Jumper 0603 (1608 Metric); Case/Package: 0603; Mounting Technology: SMT; Pins: 2
R17 = CMP-1666-00005-4: Chip Resistor, 10 KOhm, +/- 1%, 100 mW, -55 to 155 degC, 0603 (1608 Metric), RoHS, Tape and Reel; Manufacturer: Vishay Semiconductor; Voltage Rating: 75 V; Max Operating Temperature: 155 degC; PackageDescription: 2-Pin Surface Mount Device, Body 1.575 x 0.85 mm; ComponentLink1Description: Manufacturer URL; RoHSCompliant: true; PackageReference: 0603; REACH SVHC: Unknown; Length: 1.55 mm; DatasheetVersion: 06/2012; Packaging: Tape and Reel; Min Operating Temperature: -55 degC; Mounting Technology: Surface Mount; ComponentLink2URL: https://datasheet.ciiva.com/11809/0900766b80d98afc-11809037.pdf; Height: 0.45 mm; ComponentLink2Description: Datasheet; Package Quantity: 5000; ComponentLink1URL: http://www.vishay.com/
XF1 XF2 = CMP-1502-00237-2: NexarPartId: 56808807; Voltage Rating (AC): 250V; Fuse Current: 10A; REACH SVHC: Unknown; RoHS: Non-Compliant; Mount: Through Hole; Packaging: Box